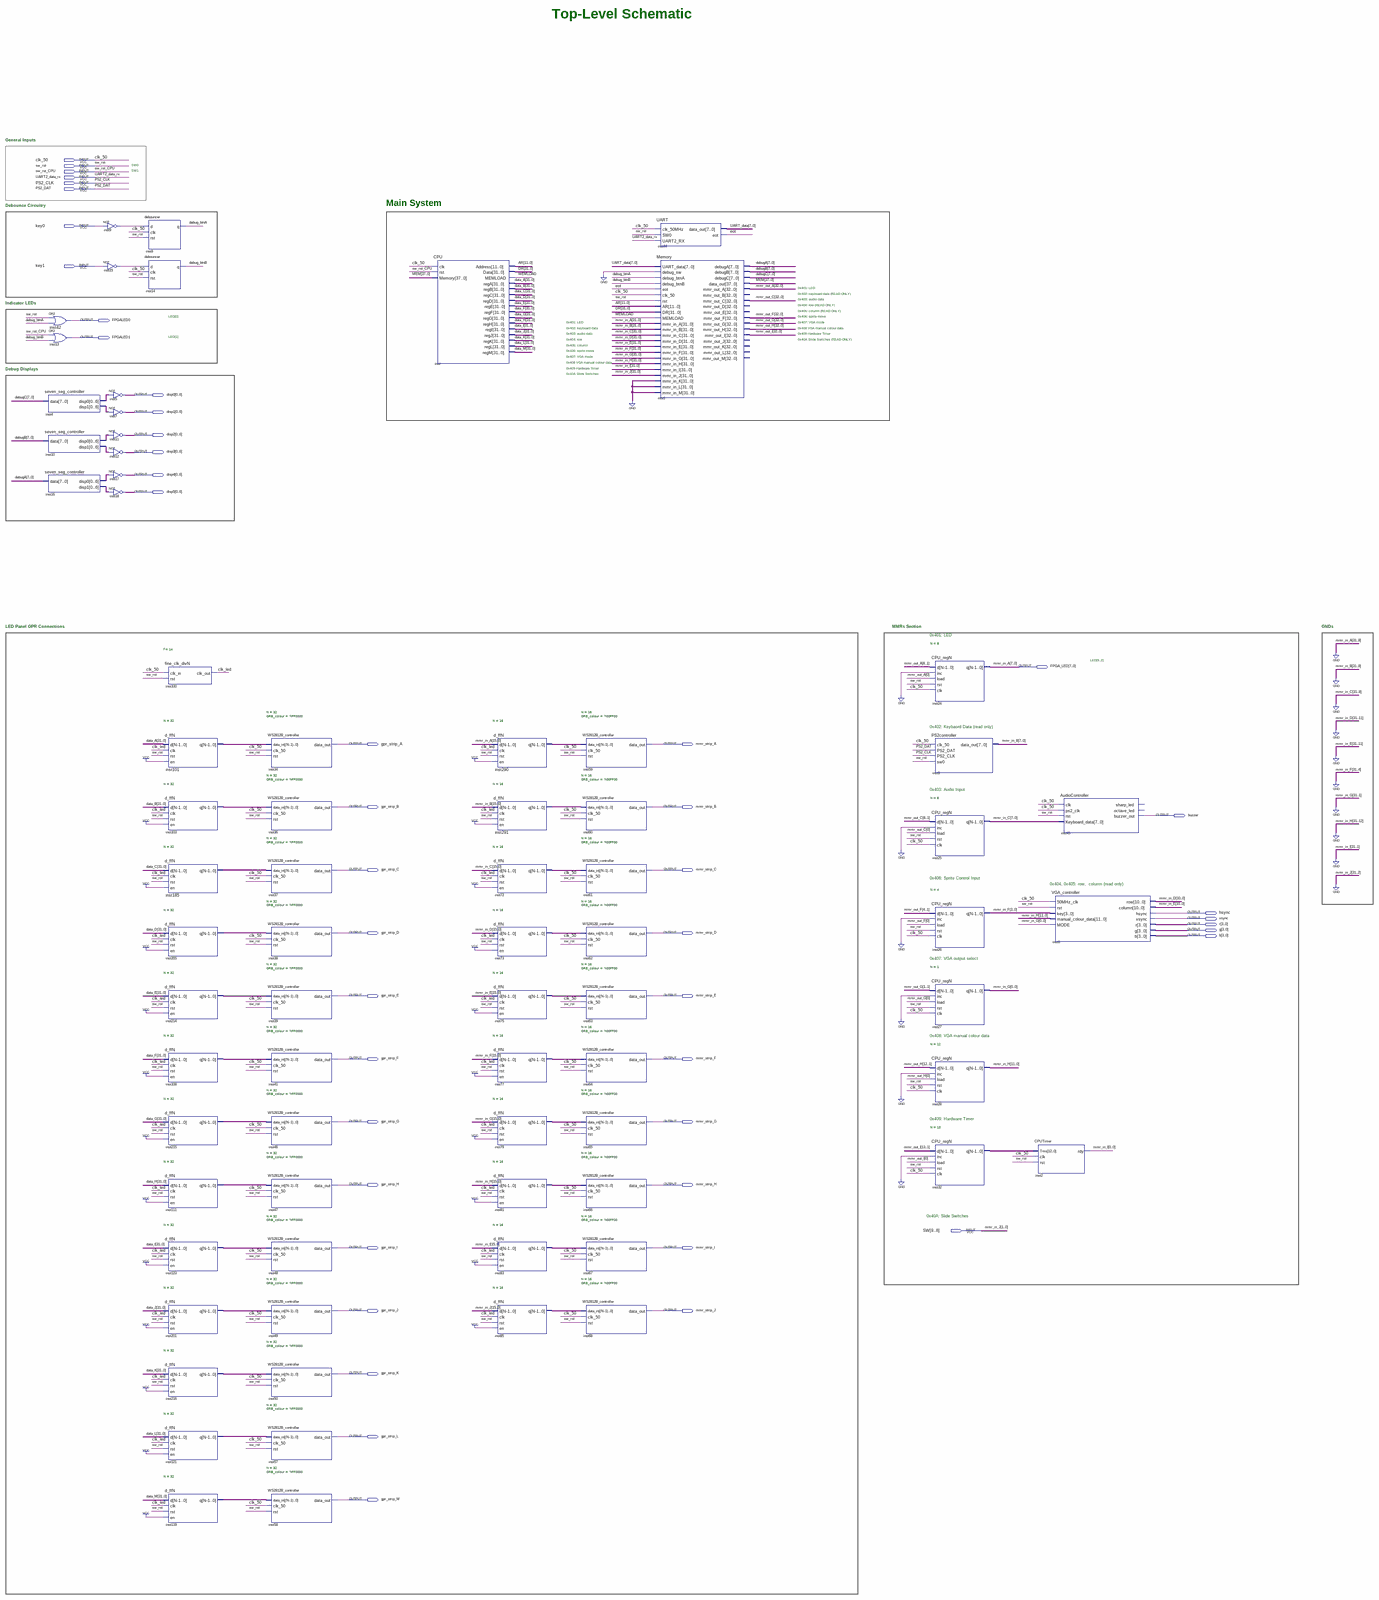
[diagram p0: schematic sheet, whole]
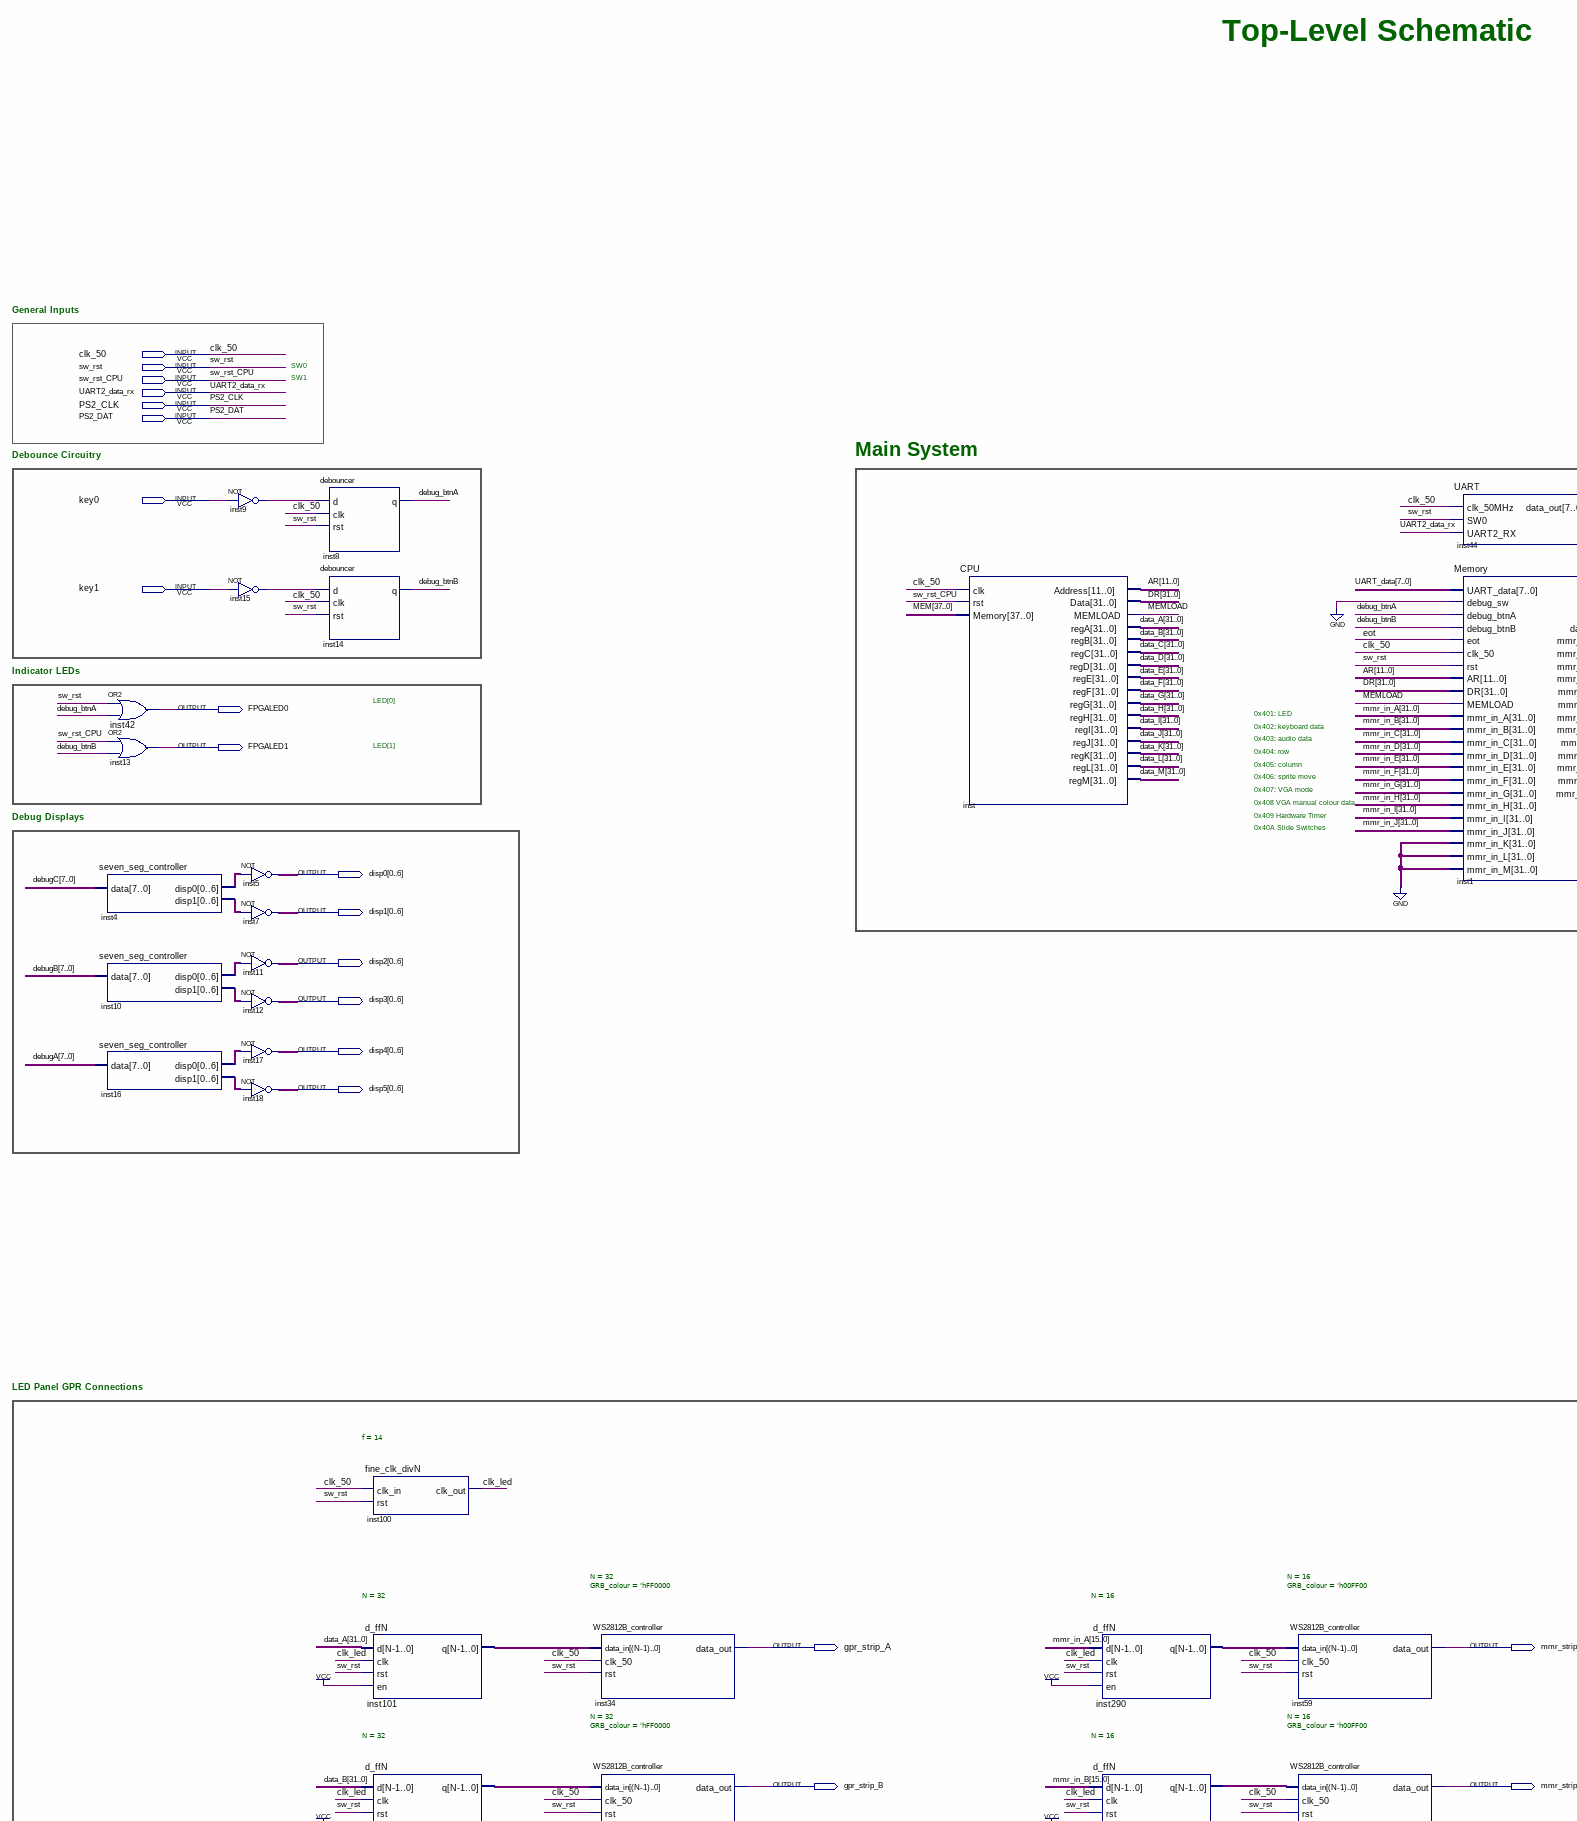
[diagram p1: schematic sheet, upper left part]
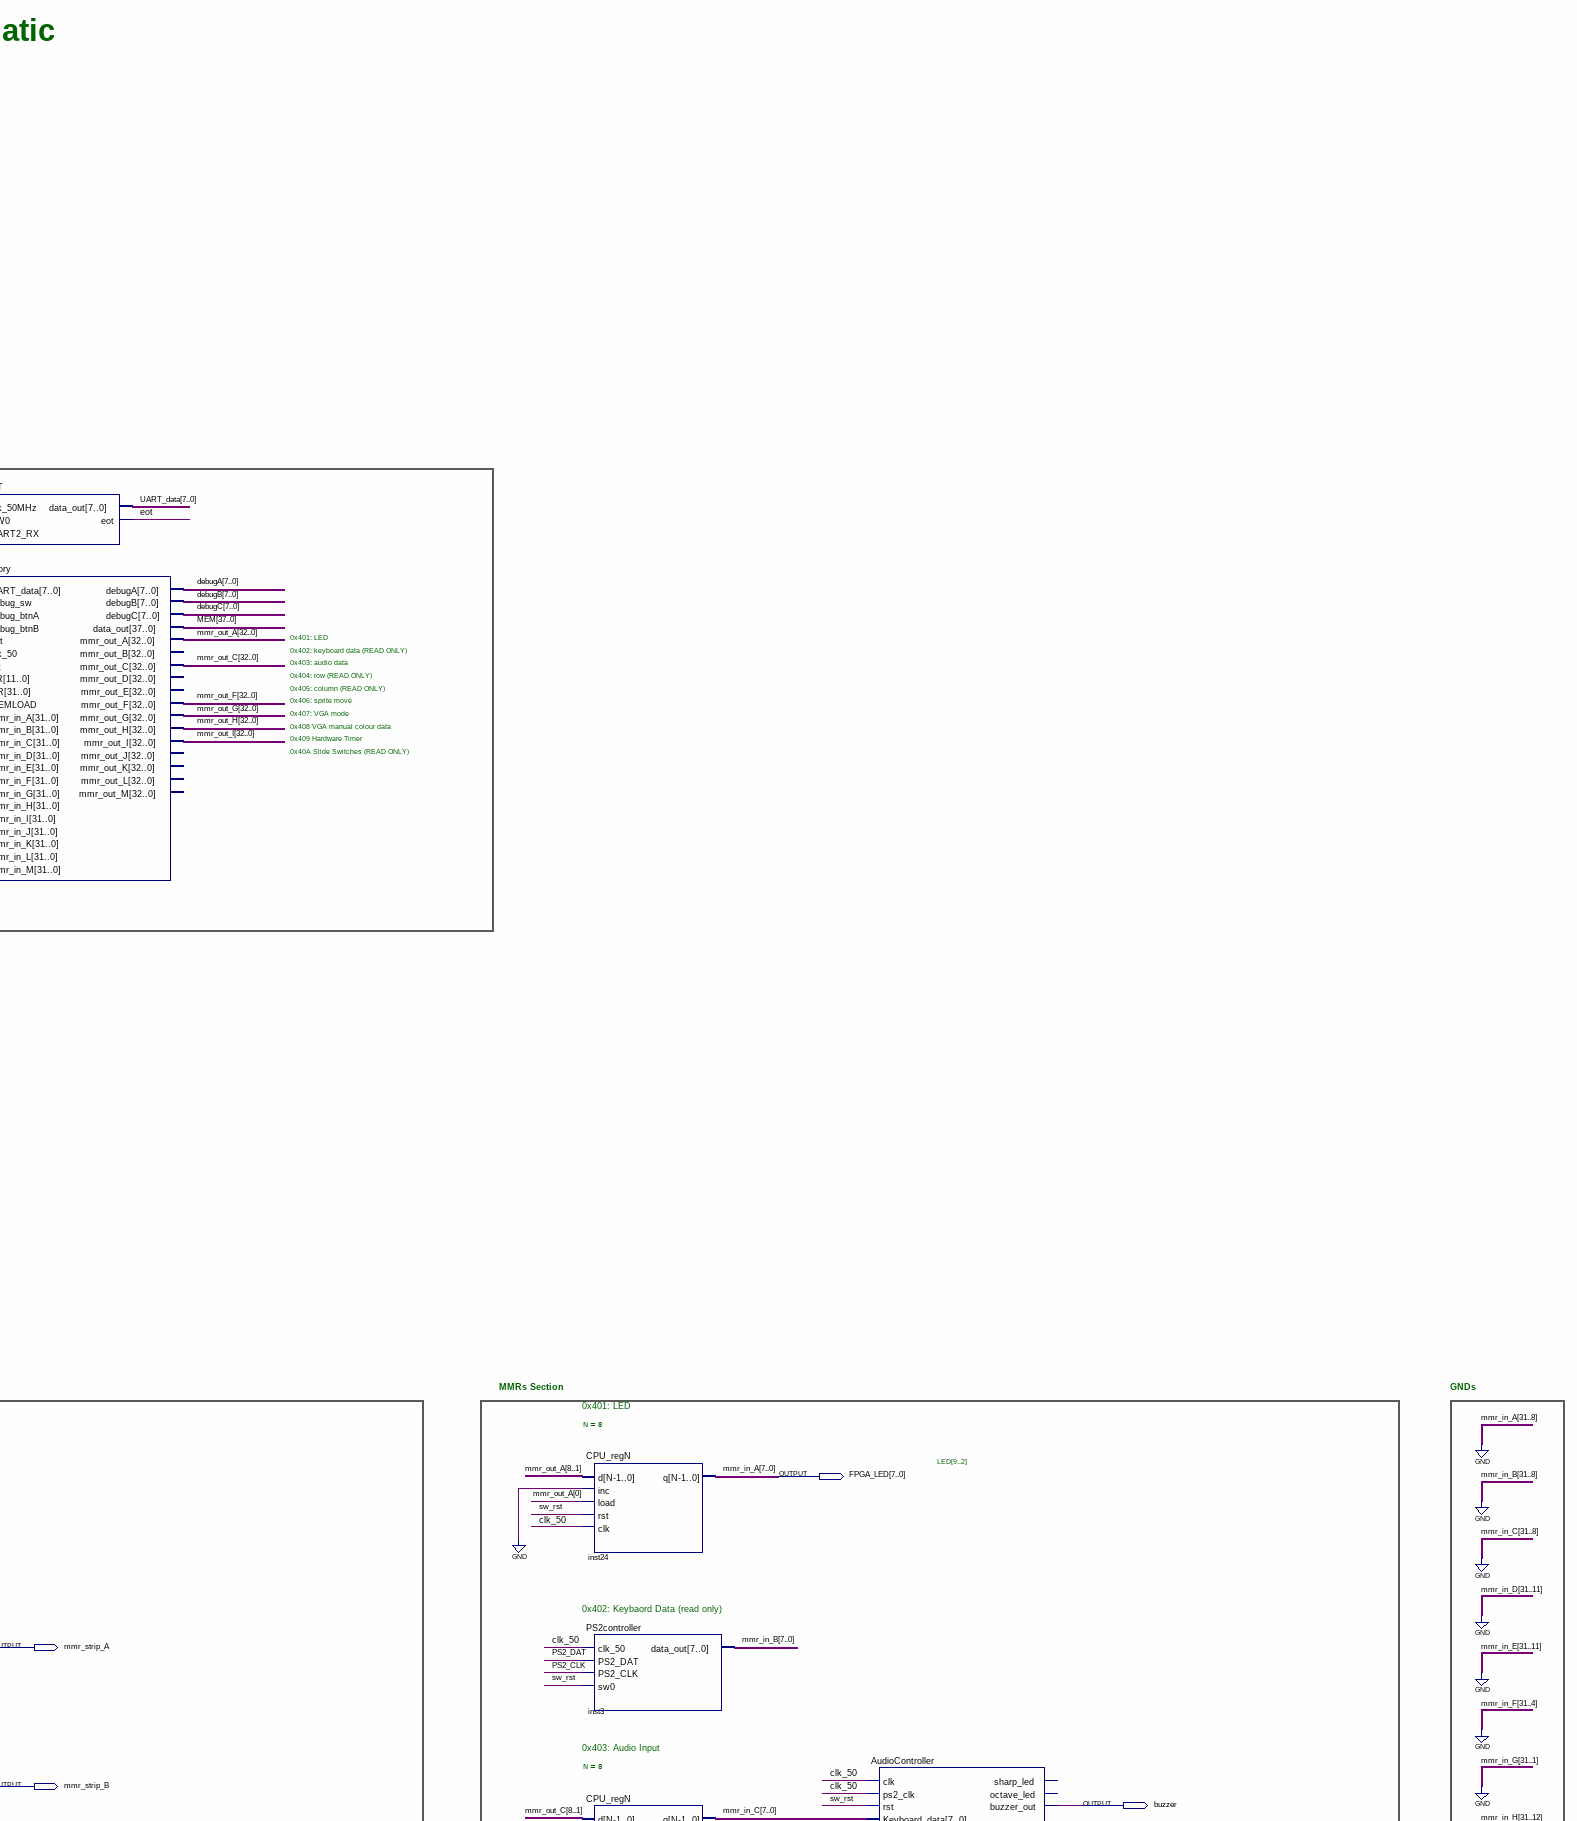
[diagram p2: schematic sheet, upper right part]
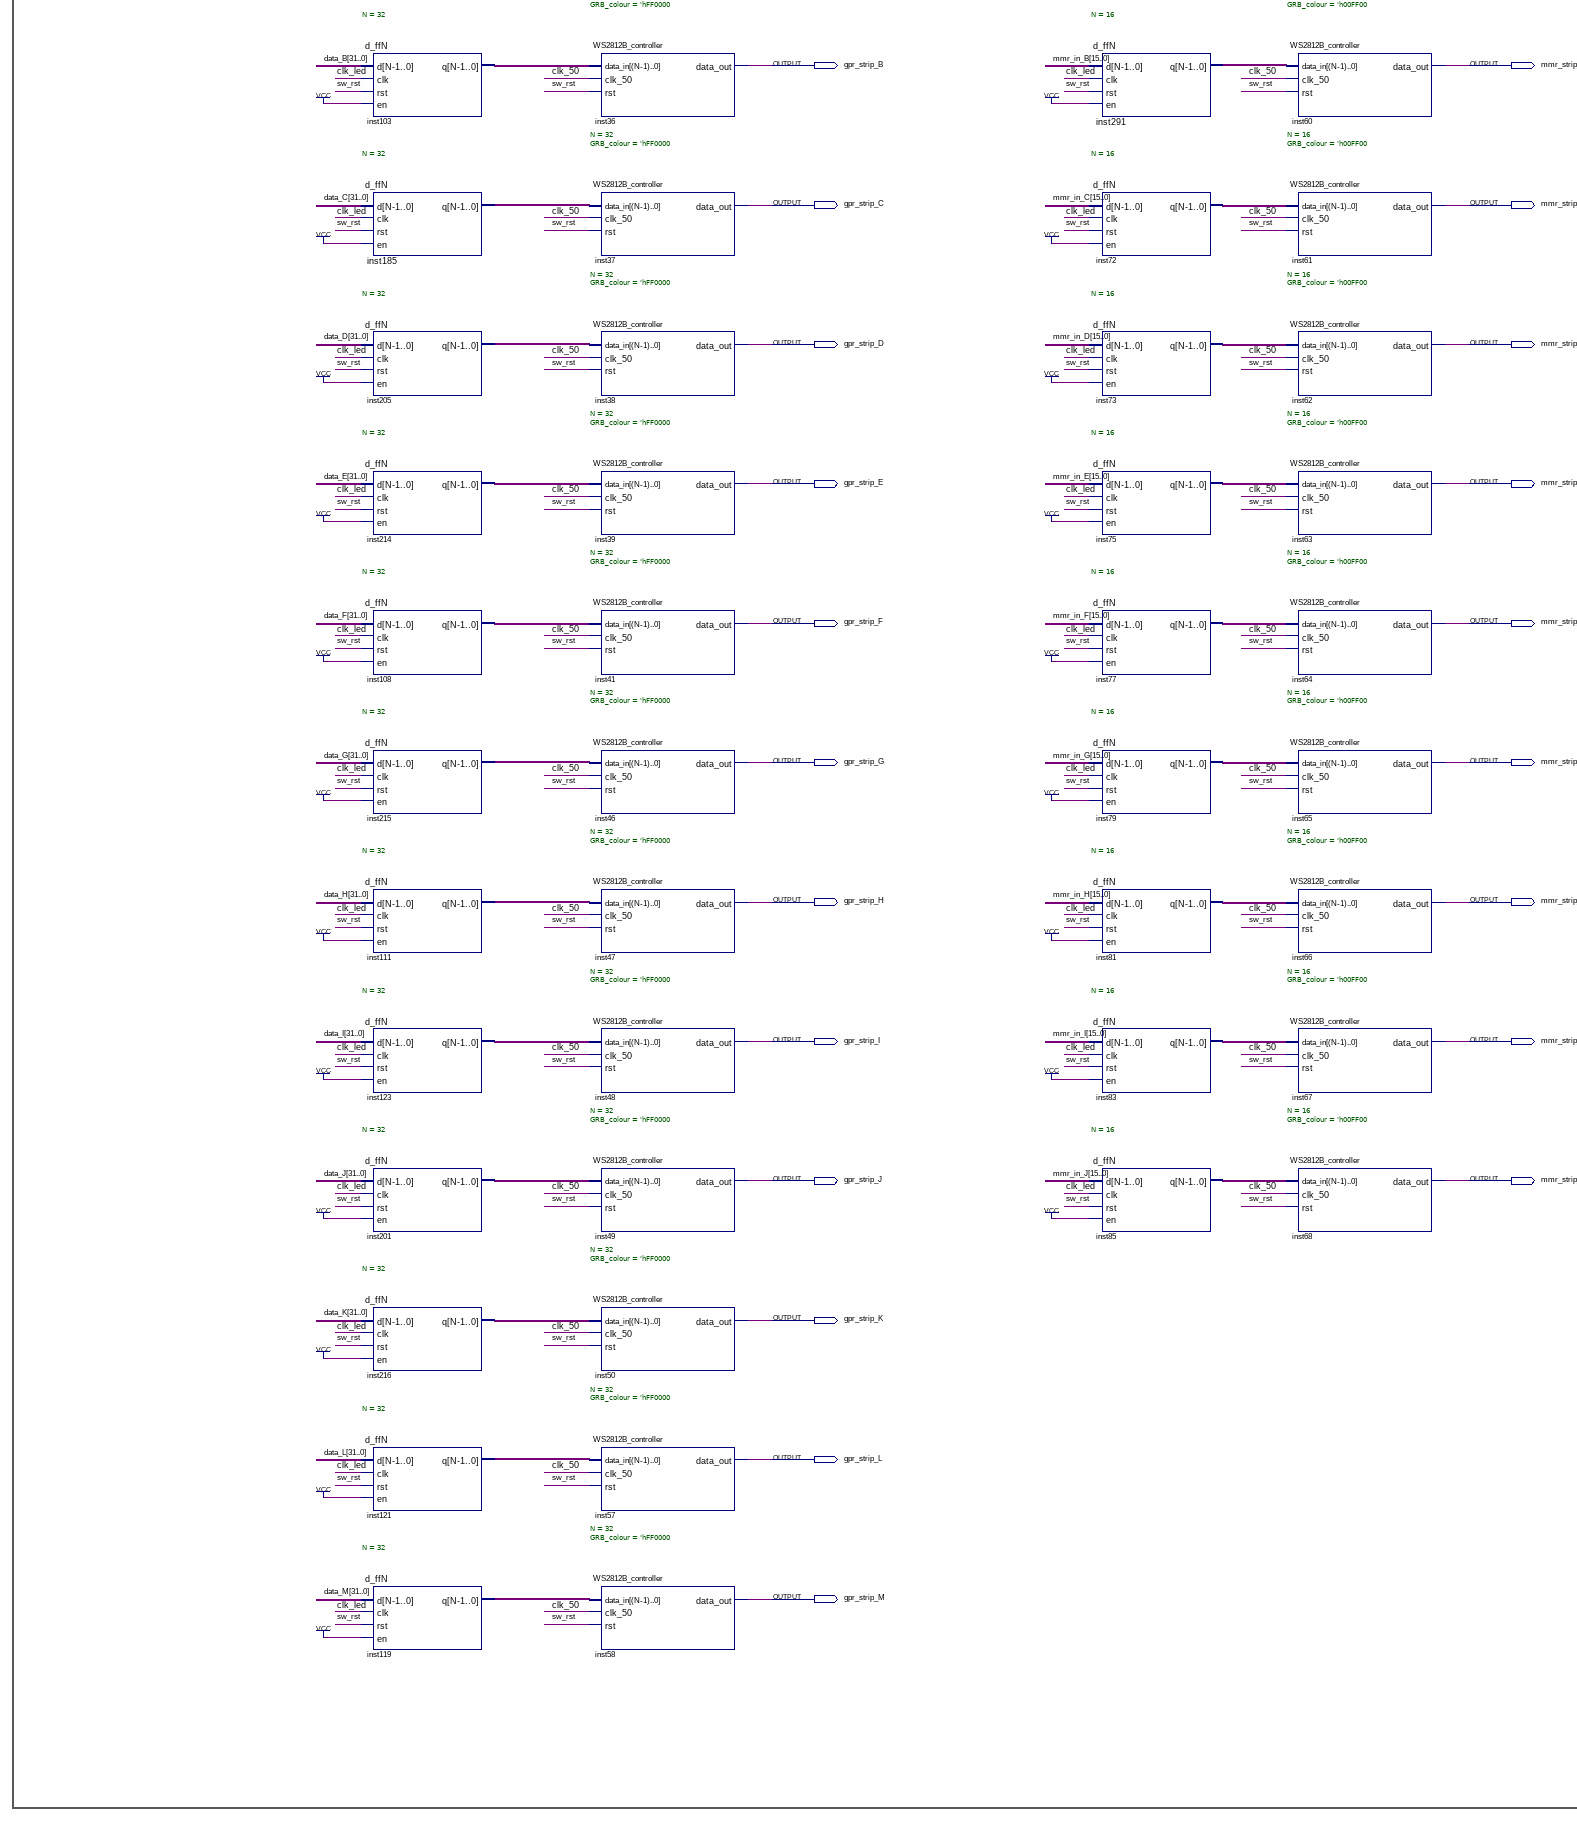
[diagram p3: schematic sheet, lower left part]
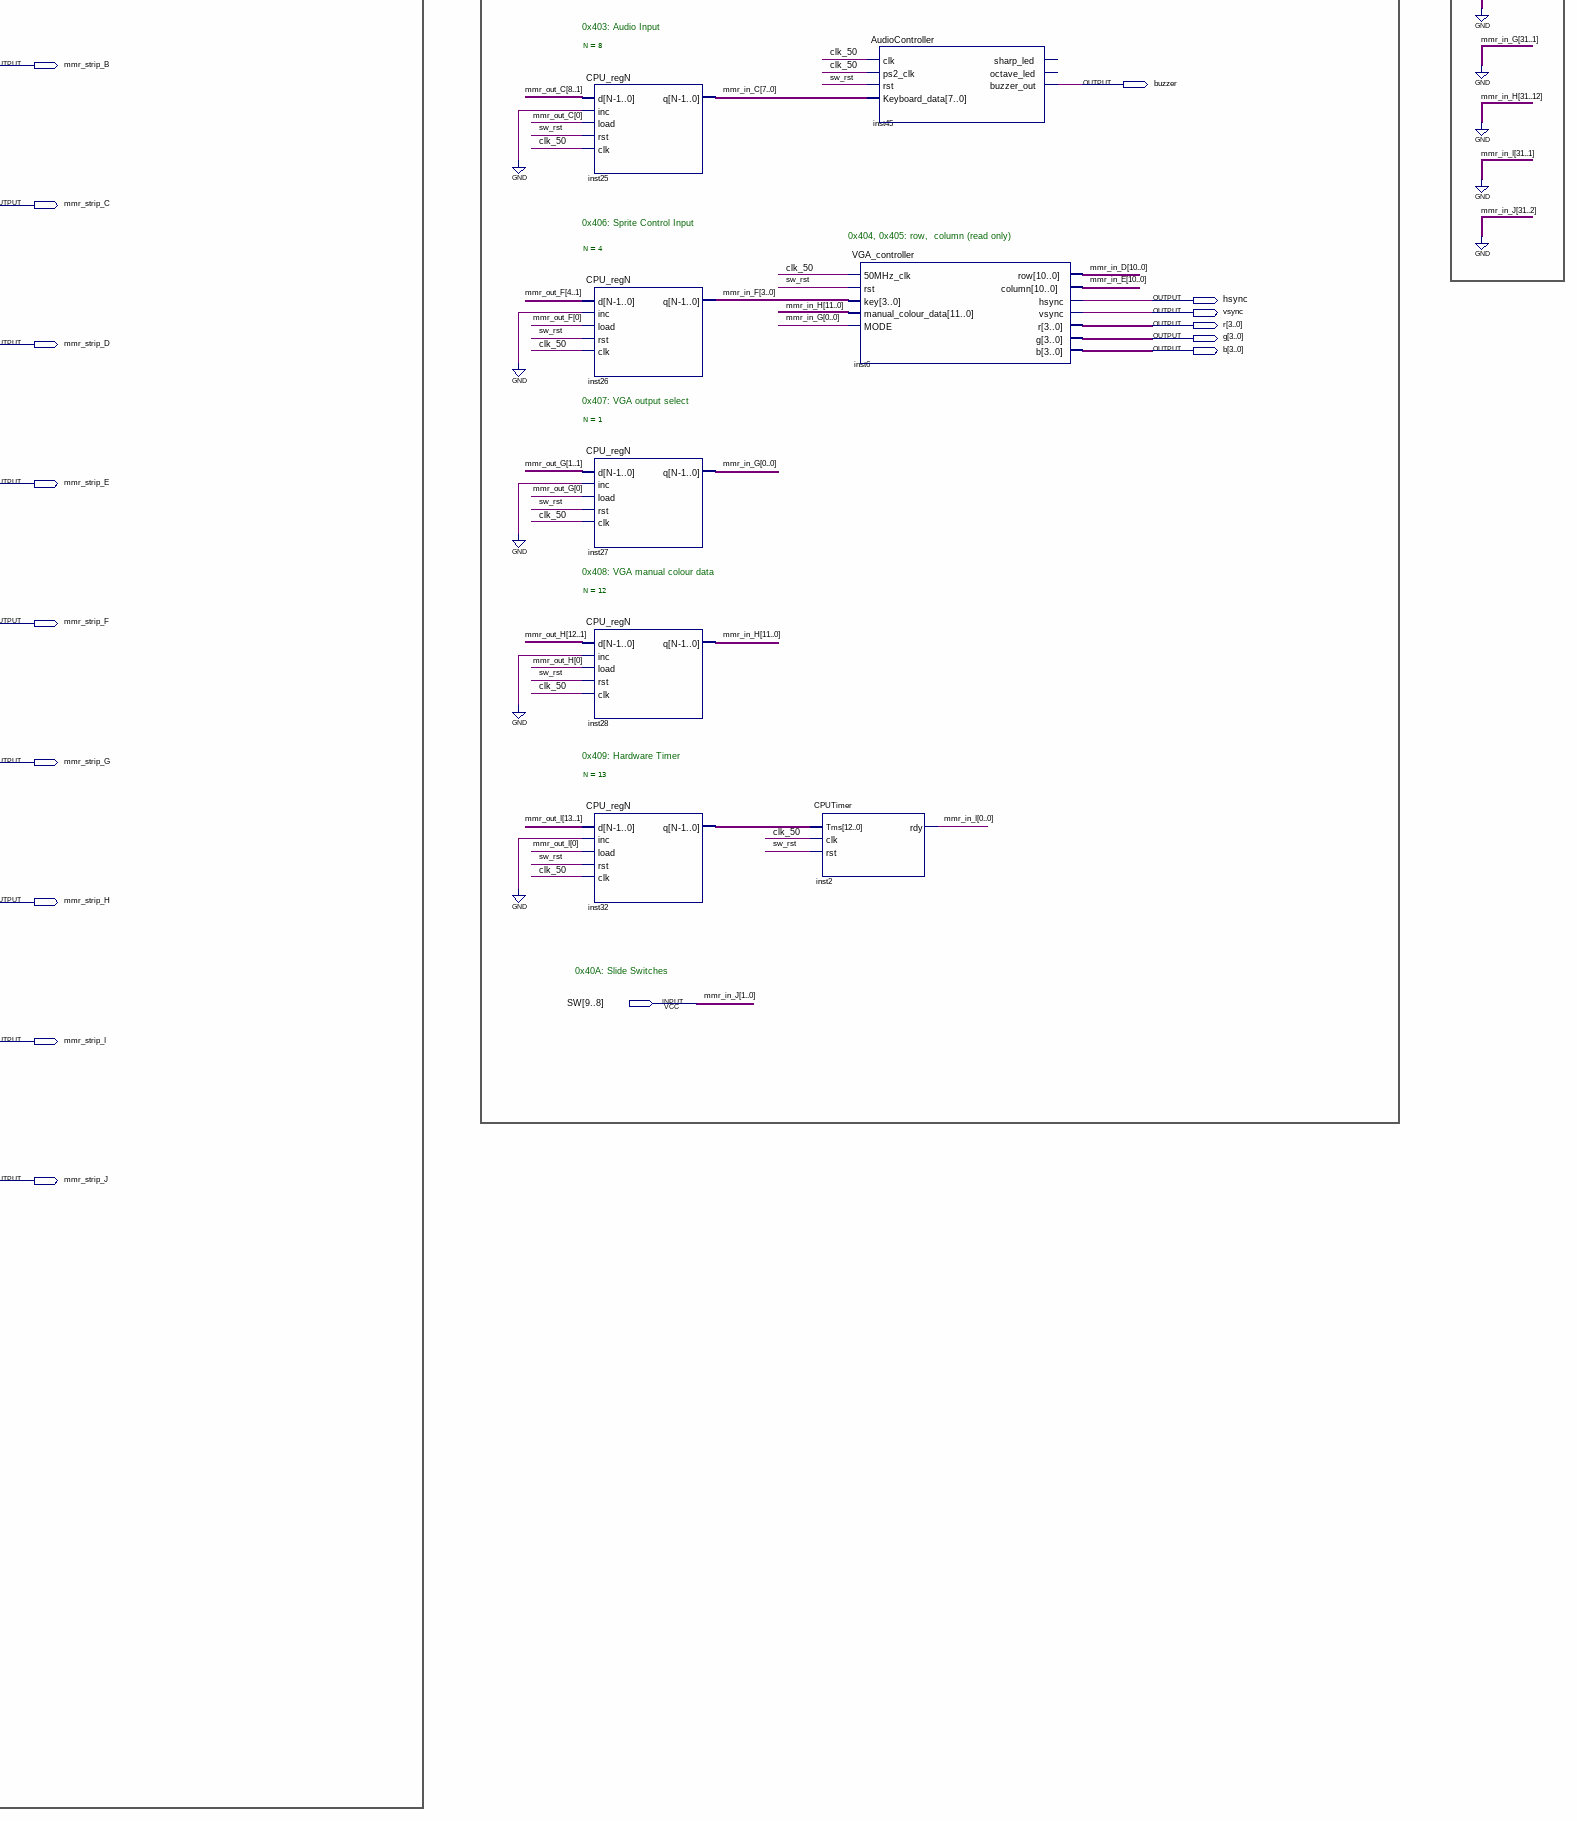
[diagram p4: schematic sheet, lower right part]
// Quartus schematic TopLevel.bdf as structural Verilog: 75 symbols, 47 pins
module TopLevel (
  input  clk_50,
  input  sw_rst,
  input  sw_rst_CPU,
  input  UART2_data_rx,
  input  PS2_CLK,
  input  PS2_DAT,
  input  key0,
  input  key1,
  input  [9:8] SW,
  output FPGALED0,
  output FPGALED1,
  output [0:6] disp0,
  output [0:6] disp1,
  output [0:6] disp2,
  output [0:6] disp3,
  output [0:6] disp4,
  output [0:6] disp5,
  output [7:0] FPGA_LED,
  output gpr_strip_A,
  output mmr_strip_A,
  output gpr_strip_B,
  output mmr_strip_B,
  output buzzer,
  output gpr_strip_C,
  output mmr_strip_C,
  output hsync,
  output vsync,
  output [3:0] r,
  output [3:0] g,
  output gpr_strip_D,
  output mmr_strip_D,
  output [3:0] b,
  output gpr_strip_E,
  output mmr_strip_E,
  output gpr_strip_F,
  output mmr_strip_F,
  output gpr_strip_G,
  output mmr_strip_G,
  output gpr_strip_H,
  output mmr_strip_H,
  output gpr_strip_I,
  output mmr_strip_I,
  output gpr_strip_J,
  output mmr_strip_J,
  output gpr_strip_K,
  output gpr_strip_L,
  output gpr_strip_M
);

  wire clk_led, debug_btnA, debug_btnB, eot, inst9_out, inst15_out, MEMLOAD;
  wire [0:0] mmr_in_G, mmr_in_I;
  wire [3:0] mmr_in_F;
  wire [6:0] inst4_disp0, inst4_disp1, inst10_disp0, inst10_disp1, inst16_disp0, inst16_disp1;
  wire [7:0] debugA, debugB, debugC, mmr_in_B, mmr_in_C, UART_data;
  wire [10:0] mmr_in_D, mmr_in_E;
  wire [11:0] AR, mmr_in_H;
  wire [12:0] inst32_q;
  wire [15:0] inst72_q, inst73_q, inst75_q, inst77_q, inst79_q, inst81_q, inst83_q, inst85_q, inst290_q,
       inst291_q;
  wire [31:0] data_A, data_B, data_C, data_D, data_E, data_F, data_G, data_H, data_I, data_J, data_K, data_L,
       data_M, DR, inst101_q, inst103_q, inst108_q, inst111_q, inst119_q, inst121_q, inst123_q, inst185_q,
       inst201_q, inst205_q, inst214_q, inst215_q, inst216_q;
  wire [32:0] mmr_out_A, mmr_out_C, mmr_out_F, mmr_out_G, mmr_out_H, mmr_out_I;
  wire [37:0] MEM;

  or inst42 (FPGALED0, sw_rst, debug_btnA);
  or inst13 (FPGALED1, sw_rst_CPU, debug_btnB);
  seven_seg_controller inst4 (.data(debugC), .disp0(inst4_disp0), .disp1(inst4_disp1));
  seven_seg_controller inst10 (.data(debugB), .disp0(inst10_disp0), .disp1(inst10_disp1));
  seven_seg_controller inst16 (.data(debugA), .disp0(inst16_disp0), .disp1(inst16_disp1));
  not inst9 (inst9_out, key0);
  not inst15 (inst15_out, key1);
  assign disp0 = ~inst4_disp0;  // NOT inst5, 7 bits wide
  assign disp1 = ~inst4_disp1;  // NOT inst7, 7 bits wide
  assign disp2 = ~inst10_disp0;  // NOT inst11, 7 bits wide
  assign disp3 = ~inst10_disp1;  // NOT inst12, 7 bits wide
  assign disp4 = ~inst16_disp0;  // NOT inst17, 7 bits wide
  assign disp5 = ~inst16_disp1;  // NOT inst18, 7 bits wide
  debouncer inst8 (.d(inst9_out), .clk(clk_50), .rst(sw_rst), .q(debug_btnA));
  debouncer inst14 (.d(inst15_out), .clk(clk_50), .rst(sw_rst), .q(debug_btnB));
  fine_clk_divN #(.f(14)) inst100 (.clk_in(clk_50), .rst(sw_rst), .clk_out(clk_led));
  d_ffN #(.N(32)) inst101 (.d(data_A), .clk(clk_led), .rst(sw_rst), .en(1'b1), .q(inst101_q));
  d_ffN #(.N(32)) inst103 (.d(data_B), .clk(clk_led), .rst(sw_rst), .en(1'b1), .q(inst103_q));
  d_ffN #(.N(32)) inst185 (.d(data_C), .clk(clk_led), .rst(sw_rst), .en(1'b1), .q(inst185_q));
  d_ffN #(.N(32)) inst205 (.d(data_D), .clk(clk_led), .rst(sw_rst), .en(1'b1), .q(inst205_q));
  d_ffN #(.N(32)) inst214 (.d(data_E), .clk(clk_led), .rst(sw_rst), .en(1'b1), .q(inst214_q));
  d_ffN #(.N(32)) inst108 (.d(data_F), .clk(clk_led), .rst(sw_rst), .en(1'b1), .q(inst108_q));
  d_ffN #(.N(32)) inst215 (.d(data_G), .clk(clk_led), .rst(sw_rst), .en(1'b1), .q(inst215_q));
  d_ffN #(.N(32)) inst111 (.d(data_H), .clk(clk_led), .rst(sw_rst), .en(1'b1), .q(inst111_q));
  d_ffN #(.N(32)) inst123 (.d(data_I), .clk(clk_led), .rst(sw_rst), .en(1'b1), .q(inst123_q));
  d_ffN #(.N(32)) inst201 (.d(data_J), .clk(clk_led), .rst(sw_rst), .en(1'b1), .q(inst201_q));
  d_ffN #(.N(32)) inst216 (.d(data_K), .clk(clk_led), .rst(sw_rst), .en(1'b1), .q(inst216_q));
  d_ffN #(.N(32)) inst121 (.d(data_L), .clk(clk_led), .rst(sw_rst), .en(1'b1), .q(inst121_q));
  d_ffN #(.N(32)) inst119 (.d(data_M), .clk(clk_led), .rst(sw_rst), .en(1'b1), .q(inst119_q));
  WS2812B_controller #(.N(32), .GRB_colour('hFF0000)) inst34 (
    .data_in(inst101_q), .clk_50(clk_50), .rst(sw_rst), .data_out(gpr_strip_A));
  WS2812B_controller #(.N(32), .GRB_colour('hFF0000)) inst36 (
    .data_in(inst103_q), .clk_50(clk_50), .rst(sw_rst), .data_out(gpr_strip_B));
  WS2812B_controller #(.N(32), .GRB_colour('hFF0000)) inst37 (
    .data_in(inst185_q), .clk_50(clk_50), .rst(sw_rst), .data_out(gpr_strip_C));
  WS2812B_controller #(.N(32), .GRB_colour('hFF0000)) inst38 (
    .data_in(inst205_q), .clk_50(clk_50), .rst(sw_rst), .data_out(gpr_strip_D));
  WS2812B_controller #(.N(32), .GRB_colour('hFF0000)) inst39 (
    .data_in(inst214_q), .clk_50(clk_50), .rst(sw_rst), .data_out(gpr_strip_E));
  WS2812B_controller #(.N(32), .GRB_colour('hFF0000)) inst41 (
    .data_in(inst108_q), .clk_50(clk_50), .rst(sw_rst), .data_out(gpr_strip_F));
  WS2812B_controller #(.N(32), .GRB_colour('hFF0000)) inst46 (
    .data_in(inst215_q), .clk_50(clk_50), .rst(sw_rst), .data_out(gpr_strip_G));
  WS2812B_controller #(.N(32), .GRB_colour('hFF0000)) inst47 (
    .data_in(inst111_q), .clk_50(clk_50), .rst(sw_rst), .data_out(gpr_strip_H));
  WS2812B_controller #(.N(32), .GRB_colour('hFF0000)) inst48 (
    .data_in(inst123_q), .clk_50(clk_50), .rst(sw_rst), .data_out(gpr_strip_I));
  WS2812B_controller #(.N(32), .GRB_colour('hFF0000)) inst49 (
    .data_in(inst201_q), .clk_50(clk_50), .rst(sw_rst), .data_out(gpr_strip_J));
  WS2812B_controller #(.N(32), .GRB_colour('hFF0000)) inst50 (
    .data_in(inst216_q), .clk_50(clk_50), .rst(sw_rst), .data_out(gpr_strip_K));
  WS2812B_controller #(.N(32), .GRB_colour('hFF0000)) inst57 (
    .data_in(inst121_q), .clk_50(clk_50), .rst(sw_rst), .data_out(gpr_strip_L));
  WS2812B_controller #(.N(32), .GRB_colour('hFF0000)) inst58 (
    .data_in(inst119_q), .clk_50(clk_50), .rst(sw_rst), .data_out(gpr_strip_M));
  CPU inst (
    .clk(clk_50), .rst(sw_rst_CPU), .Memory(MEM), .Address(AR), .Data(DR), .MEMLOAD(MEMLOAD), .regA(data_A),
    .regB(data_B), .regC(data_C), .regD(data_D), .regE(data_E), .regF(data_F), .regG(data_G), .regH(data_H),
    .regI(data_I), .regJ(data_J), .regK(data_K), .regL(data_L), .regM(data_M));
  d_ffN #(.N(16)) inst290 (.d({{8{1'b0}}, FPGA_LED}), .clk(clk_led), .rst(sw_rst), .en(1'b1), .q(inst290_q));
  d_ffN #(.N(16)) inst291 (.d({{8{1'b0}}, mmr_in_B}), .clk(clk_led), .rst(sw_rst), .en(1'b1), .q(inst291_q));
  d_ffN #(.N(16)) inst72 (.d({{8{1'b0}}, mmr_in_C}), .clk(clk_led), .rst(sw_rst), .en(1'b1), .q(inst72_q));
  d_ffN #(.N(16)) inst73 (.d({{5{1'b0}}, mmr_in_D}), .clk(clk_led), .rst(sw_rst), .en(1'b1), .q(inst73_q));
  d_ffN #(.N(16)) inst75 (.d({{5{1'b0}}, mmr_in_E}), .clk(clk_led), .rst(sw_rst), .en(1'b1), .q(inst75_q));
  d_ffN #(.N(16)) inst77 (.d({{12{1'b0}}, mmr_in_F}), .clk(clk_led), .rst(sw_rst), .en(1'b1), .q(inst77_q));
  d_ffN #(.N(16)) inst79 (.d({{15{1'b0}}, mmr_in_G[0]}), .clk(clk_led), .rst(sw_rst), .en(1'b1), .q(inst79_q));
  d_ffN #(.N(16)) inst81 (.d({4'b0000, mmr_in_H}), .clk(clk_led), .rst(sw_rst), .en(1'b1), .q(inst81_q));
  d_ffN #(.N(16)) inst83 (.d({{15{1'b0}}, mmr_in_I[0]}), .clk(clk_led), .rst(sw_rst), .en(1'b1), .q(inst83_q));
  d_ffN #(.N(16)) inst85 (.d({{14{1'b0}}, SW}), .clk(clk_led), .rst(sw_rst), .en(1'b1), .q(inst85_q));
  WS2812B_controller #(.N(16), .GRB_colour('h00FF00)) inst59 (
    .data_in(inst290_q), .clk_50(clk_50), .rst(sw_rst), .data_out(mmr_strip_A));
  WS2812B_controller #(.N(16), .GRB_colour('h00FF00)) inst60 (
    .data_in(inst291_q), .clk_50(clk_50), .rst(sw_rst), .data_out(mmr_strip_B));
  WS2812B_controller #(.N(16), .GRB_colour('h00FF00)) inst61 (
    .data_in(inst72_q), .clk_50(clk_50), .rst(sw_rst), .data_out(mmr_strip_C));
  WS2812B_controller #(.N(16), .GRB_colour('h00FF00)) inst62 (
    .data_in(inst73_q), .clk_50(clk_50), .rst(sw_rst), .data_out(mmr_strip_D));
  WS2812B_controller #(.N(16), .GRB_colour('h00FF00)) inst63 (
    .data_in(inst75_q), .clk_50(clk_50), .rst(sw_rst), .data_out(mmr_strip_E));
  WS2812B_controller #(.N(16), .GRB_colour('h00FF00)) inst64 (
    .data_in(inst77_q), .clk_50(clk_50), .rst(sw_rst), .data_out(mmr_strip_F));
  WS2812B_controller #(.N(16), .GRB_colour('h00FF00)) inst65 (
    .data_in(inst79_q), .clk_50(clk_50), .rst(sw_rst), .data_out(mmr_strip_G));
  WS2812B_controller #(.N(16), .GRB_colour('h00FF00)) inst66 (
    .data_in(inst81_q), .clk_50(clk_50), .rst(sw_rst), .data_out(mmr_strip_H));
  WS2812B_controller #(.N(16), .GRB_colour('h00FF00)) inst67 (
    .data_in(inst83_q), .clk_50(clk_50), .rst(sw_rst), .data_out(mmr_strip_I));
  WS2812B_controller #(.N(16), .GRB_colour('h00FF00)) inst68 (
    .data_in(inst85_q), .clk_50(clk_50), .rst(sw_rst), .data_out(mmr_strip_J));
  UART inst44 (.clk_50MHz(clk_50), .SW0(sw_rst), .UART2_RX(UART2_data_rx), .data_out(UART_data), .eot(eot));
  Memory inst1 (
    .clk_50(clk_50), .UART_data(UART_data), .rst(sw_rst), .AR(AR), .DR(DR), .eot(eot), .MEMLOAD(MEMLOAD),
    .debug_sw(1'b0), .debug_btnA(debug_btnA), .debug_btnB(debug_btnB), .mmr_in_A({{24{1'b0}}, FPGA_LED}),
    .mmr_in_B({{24{1'b0}}, mmr_in_B}), .mmr_in_C({{24{1'b0}}, mmr_in_C}), .mmr_in_D({{21{1'b0}}, mmr_in_D}),
    .mmr_in_E({{21{1'b0}}, mmr_in_E}), .mmr_in_F({{28{1'b0}}, mmr_in_F}),
    .mmr_in_G({{31{1'b0}}, mmr_in_G[0]}), .mmr_in_H({{20{1'b0}}, mmr_in_H}),
    .mmr_in_I({{31{1'b0}}, mmr_in_I[0]}), .mmr_in_J({{30{1'b0}}, SW}), .mmr_in_K({32{1'b0}}),
    .mmr_in_L({32{1'b0}}), .mmr_in_M({32{1'b0}}), .debugA(debugA), .debugB(debugB), .debugC(debugC),
    .mmr_out_A(mmr_out_A), .data_out(MEM), .mmr_out_C(mmr_out_C), .mmr_out_F(mmr_out_F),
    .mmr_out_G(mmr_out_G), .mmr_out_H(mmr_out_H), .mmr_out_I(mmr_out_I));  // open: mmr_out_B, mmr_out_D, mmr_out_E, mmr_out_J, mmr_out_K, mmr_out_L, mmr_out_M
  CPU_regN #(.N(8)) inst24 (
    .d(mmr_out_A[8:1]), .inc(1'b0), .load(mmr_out_A[0]), .rst(sw_rst), .clk(clk_50), .q(FPGA_LED));
  PS2controller inst3 (.clk_50(clk_50), .PS2_DAT(PS2_DAT), .PS2_CLK(PS2_CLK), .sw0(sw_rst), .data_out(mmr_in_B));
  CPU_regN #(.N(8)) inst25 (
    .d(mmr_out_C[8:1]), .inc(1'b0), .load(mmr_out_C[0]), .rst(sw_rst), .clk(clk_50), .q(mmr_in_C));
  CPU_regN #(.N(4)) inst26 (
    .d(mmr_out_F[4:1]), .inc(1'b0), .load(mmr_out_F[0]), .rst(sw_rst), .clk(clk_50), .q(mmr_in_F));
  CPU_regN #(.N(1)) inst27 (
    .d(mmr_out_G[1]), .inc(1'b0), .load(mmr_out_G[0]), .rst(sw_rst), .clk(clk_50), .q(mmr_in_G[0]));
  CPU_regN #(.N(12)) inst28 (
    .d(mmr_out_H[12:1]), .inc(1'b0), .load(mmr_out_H[0]), .rst(sw_rst), .clk(clk_50), .q(mmr_in_H));
  CPU_regN #(.N(13)) inst32 (
    .d(mmr_out_I[13:1]), .inc(1'b0), .load(mmr_out_I[0]), .rst(sw_rst), .clk(clk_50), .q(inst32_q));
  CPUTimer inst2 (.Tms(inst32_q), .clk(clk_50), .rst(sw_rst), .rdy(mmr_in_I[0]));
  AudioController inst45 (
    .clk(clk_50), .ps2_clk(clk_50), .rst(sw_rst), .Keyboard_data(mmr_in_C), .buzzer_out(buzzer));  // open: sharp_led, octave_led
  VGA_controller inst6 (
    .\50MHz_clk (clk_50), .rst(sw_rst), .key(mmr_in_F), .manual_colour_data(mmr_in_H), .MODE(mmr_in_G[0]),
    .hsync(hsync), .column(mmr_in_E), .vsync(vsync), .row(mmr_in_D), .r(r), .g(g), .b(b));

  // Other names for the same wires on the sheet: mmr_in_A[7:0] = FPGA_LED; mmr_in_J[1:0] = SW

  // Notes on the sheet:
  //   Top-Level Schematic
  //   General Inputs
  //   SW0
  //   SW1
  //   Main System
  //   Debounce Circuitry
  //   0x401: LED
  //   0x402: keyboard data (READ ONLY)
  //   0x403: audio data
  //   Indicator LEDs
  //   0x404: row (READ ONLY)
  //   0x405: column (READ ONLY)
  //   LED[0]
  //   0x406: sprite move
  //   0x401: LED
  //   0x407: VGA mode
  //   0x402: keyboard data
  //   0x408 VGA manual colour data
  //   0x403: audio data
  //   0x409 Hardware Timer
  //   LED[1]
  //   0x404: row
  //   0x40A Slide Switches (READ ONLY)
  //   0x405: column
  //   0x406: sprite move
  //   0x407: VGA mode
  //   0x408 VGA manual colour data
  //   Debug Displays
  //   0x409 Hardware Timer
  //   0x40A Slide Switches
  //   LED Panel GPR Connections
  //   MMRs Section
  //   GNDs
  //   0x401: LED
  //   LED[9..2]
  //   0x402: Keybaord Data (read only)
  //   0x403: Audio Input
  //   0x406: Sprite Control Input
  //   0x404, 0x405: row,  column (read only)
  //   0x407: VGA output select
  //   0x408: VGA manual colour data
  //   0x409: Hardware Timer
  //   0x40A: Slide Switches
endmodule
